# Altium project PCB_Project.PrjPcb
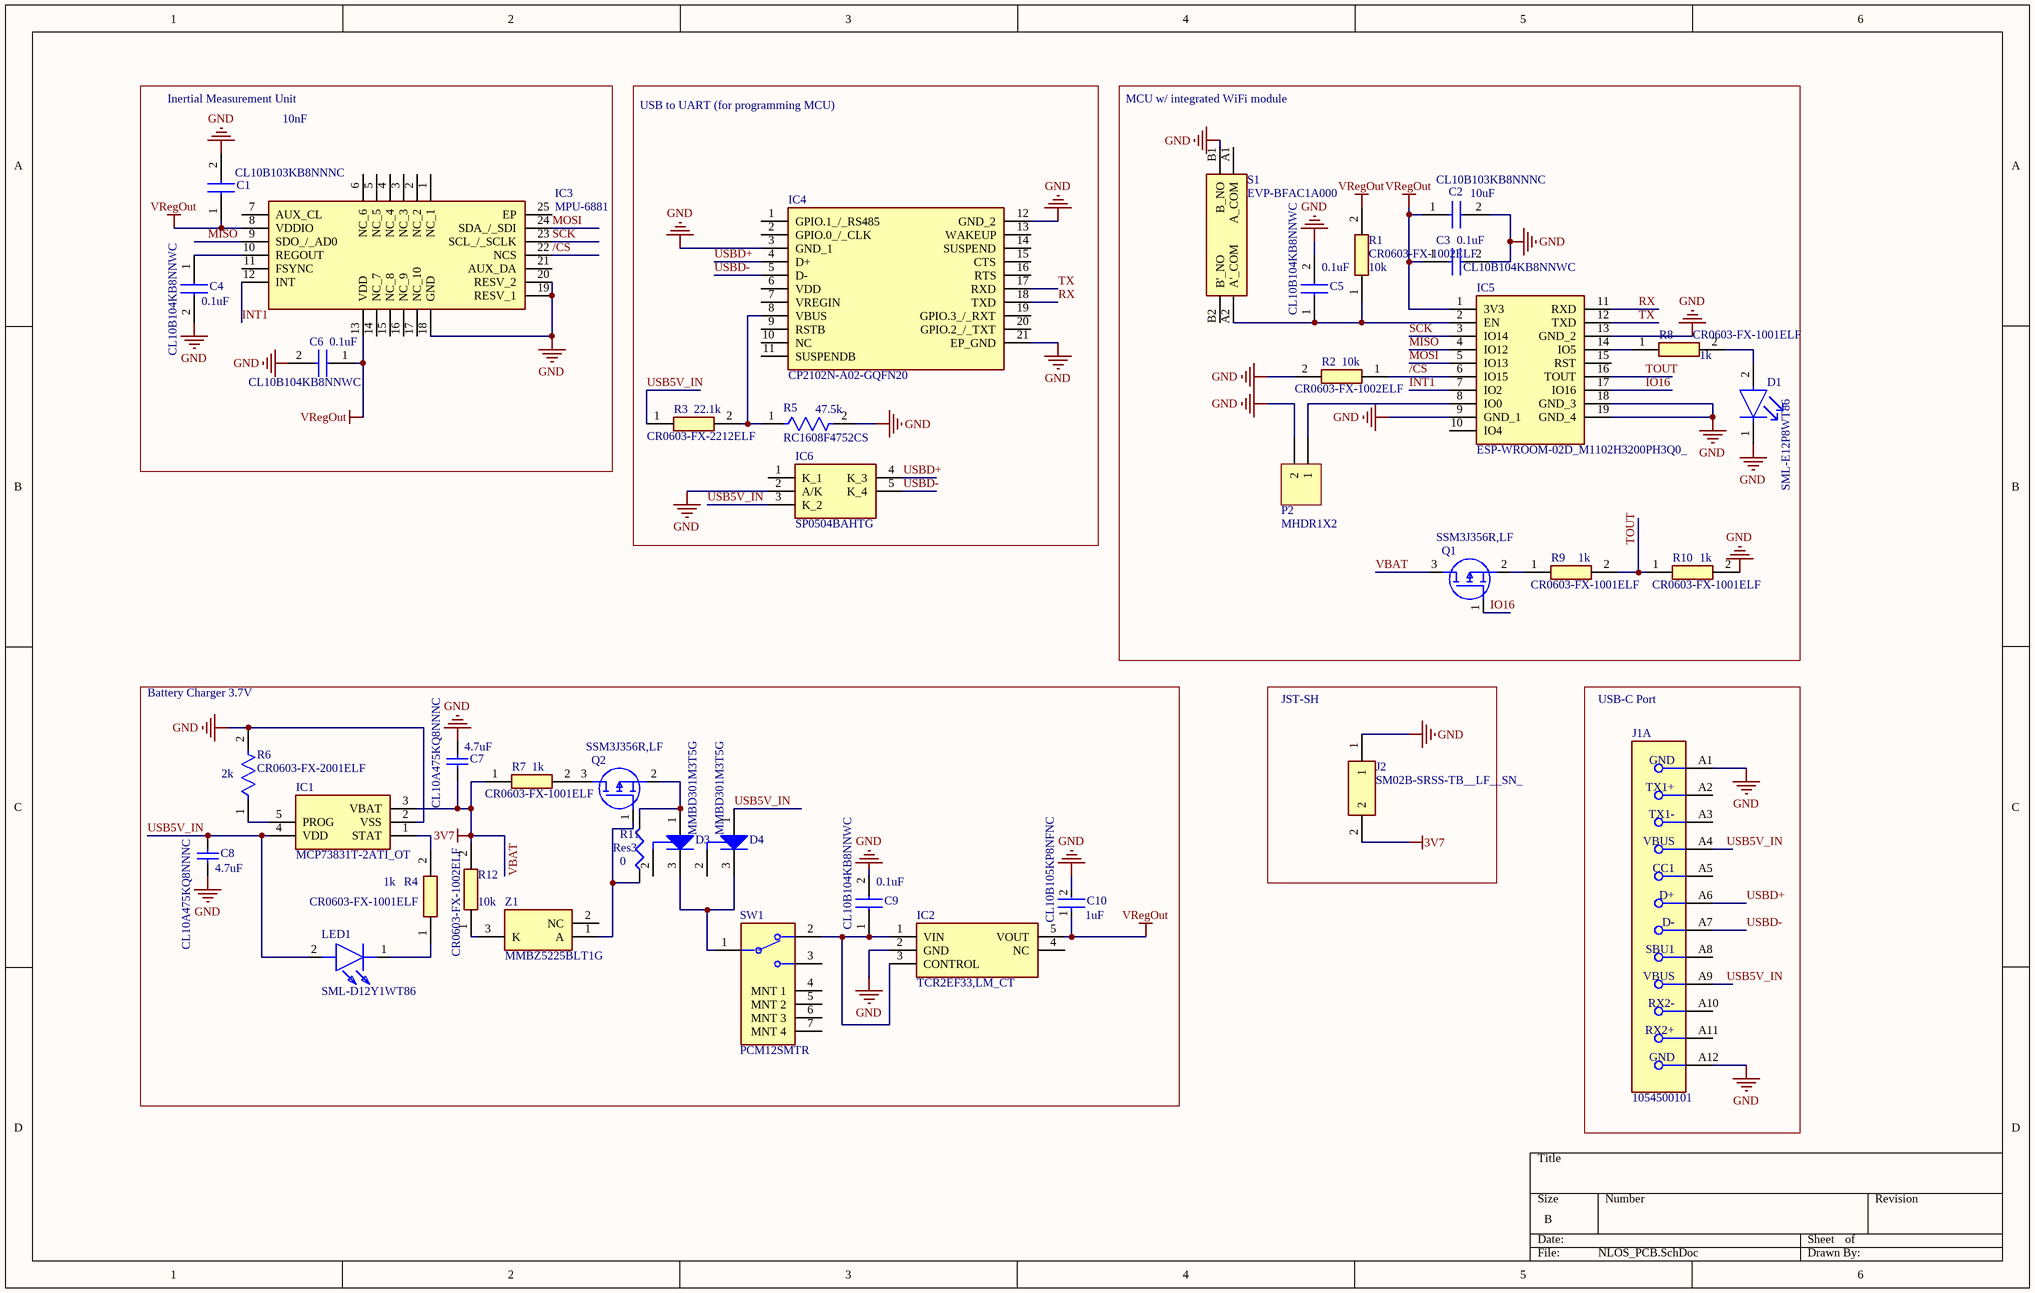
[diagram p0: NLOS_PCB.SchDoc]
1 sheet, 40 parts. Net scope: global (net labels, ports and power ports of the same name join across sheets).
Board file: PCB1.PcbDoc

## Sheet NLOS_PCB.SchDoc
size B; SheetNumber: 1; SheetTotal: 1

### Parts
C1  CL10B103KB8NNNC  [CAPC1608X90N]
C2  CL10B103KB8NNNC  [CAPC1608X90N]
C3  CL10B104KB8NNWC  [CAPC1608X90N]
C4  CL10B104KB8NNWC  [CAPC1608X90N]
C5  CL10B104KB8NNWC  [CAPC1608X90N]
C6  CL10B104KB8NNWC  [CAPC1608X90N]
C7  CL10A475KQ8NNNC  [CAPC1608X90X30LL10T20]
C8  CL10A475KQ8NNNC  [CAPC1608X90X30LL10T20]
C9  CL10B104KB8NNWC  [CAPC1608X90N]
C10  CL10B105KP8NFNC  [FP-CL10-IPC_B]
D1  SML-E12P8WT86  [FP-SML-E12-MFG]
D3  MMBD301M3T5G  [ONSC-SOT-723-3-631AA-01_V]
D4  MMBD301M3T5G  [ONSC-SOT-723-3-631AA-01_V]
IC1  MCP73831T-2ATI_OT  [SOT95P270X145-5N]
IC2  TCR2EF33,LM_CT  [SOT-25]
IC3  MPU-6881  [QFN40P300X300X95-25N-D]
IC4  CP2102N-A02-GQFN20  [CP2102NA02GQFN20]
IC5  ESP-WROOM-02D_M1102H3200PH3Q0_  [ESPWROOM02DM1102H3200PH3Q0]
IC6  SP0504BAHTG  [SOT95P280X145-5N]
J1  1054500101  [FP-1054500101-MFG]  (part A of 3)
J2  SM02B-SRSS-TB__LF__SN_  [SM02B-SRSS-TB]
LED1  SML-D12Y1WT86  [LEDC1608X55N]
P2  MHDR1X2  [MHDR1X2]
Q1  SSM3J356R,LF  [SOT96P240X110-3N]
Q2  SSM3J356R,LF  [SOT96P240X110-3N]
R1  CR0603-FX-1002ELF  [RESC1608X55N]
R2  CR0603-FX-1002ELF  [RESC1608X55N]
R3  CR0603-FX-2212ELF  [RESC1608X55N]
R4  CR0603-FX-1001ELF  [RESC1608X55N]
R5  RC1608F4752CS  [FP-RC1608-MFG]
R6  CR0603-FX-2001ELF  [FP-CR0603-IPC_A]
R7  CR0603-FX-1001ELF  [RESC1608X55N]
R8  CR0603-FX-1001ELF  [RESC1608X55N]
R9  CR0603-FX-1001ELF  [RESC1608X55N]
R10  CR0603-FX-1001ELF  [RESC1608X55N]
R11  Res3  value 0  [J1-0603]
R12  CR0603-FX-1002ELF  [RESC1608X55N]
S1  EVP-BFAC1A000  [EVPBFAC1A000]
SW1  PCM12SMTR  [FP-PCM12SMTR-MFG]
Z1  MMBZ5225BLT1G  [SOT96P237X111-3N]

### Blocks framed on the sheet
JST-SH: J2
USB-C Port: J1

### Nets
GND: C1.2 C2.2 C3.2 C4.2 C5.2 C6.2 C7.2 C8.1 C9.2 C10.2 D1.1(C) IC1.2(VSS) IC2.2(GND) IC3.18(GND) IC3.19(RESV_1) IC3.20(RESV_2) IC4.3(GND_1) IC4.12(GND_2) IC4.21(EP_GND) IC5.9(GND_1) IC5.13(GND_2) IC5.18(GND_3) IC5.19(GND_4) IC6.2(A/K) J1.A1(GND) J1.A12(GND) J2.1 P2.2 R2.2 R5.2 R6.2 R10.2 S1.B1(B_NO)
VBAT: C7.1 IC1.3(VBAT) J2.2 Q1.3(D) R7.1 R12.2  [also labelled 3V7]
VRegOut: C1.1 C2.1 C3.1 C6.1 C10.1 IC2.5(VOUT) IC3.8(VDDIO) IC3.13(VDD) IC5.1(3V3) R1.2
/CS: IC3.22(NCS) IC5.6(IO15) R2.1
INT1: IC3.12(INT) IC5.7(IO2)
IO16: IC5.17(IO16) Q1.1(G)
MISO: IC3.9(SDO_/_AD0) IC5.4(IO12)
MOSI: IC3.24(SDA_/_SDI) IC5.5(IO13)
RX: IC4.18(TXD) IC5.11(RXD)
SCK: IC3.23(SCL_/_SCLK) IC5.3(IO14)
TOUT: IC5.16(TOUT) R9.2 R10.1
TX: IC4.17(RXD) IC5.12(TXD)
USB5V_IN: C8.2 D4.1(A) IC1.4(VDD) IC6.3(K_2) J1.A4(VBUS) J1.A9(VBUS) LED1.2(A) R3.1
USBD+: IC4.4(D+) IC6.4(K_3) J1.A6(D+)
USBD-: IC4.5(D-) IC6.5(K_4) J1.A7(D-)
NetC4_1: C4.1 IC3.10(REGOUT)
NetC5_1: C5.1 IC5.2(EN) R1.1 S1.A2(A'_COM)
NetC9_1: C9.1 IC2.1(VIN) IC2.3(CONTROL) SW1.2
NetD1_2: D1.2(A) R8.2
NetD3_1: D3.1(A) Q2.2(S) R11.2
NetD3_3: D3.3(K) D4.3(K) SW1.1
NetIC1_1: IC1.1(STAT) R4.2
NetIC1_5: IC1.5(PROG) R6.1
NetIC4_8: IC4.8(VBUS) R3.2 R5.1
NetIC5_8: IC5.8(IO0) P2.1
NetIC5_14: IC5.14(IO5) R8.1
NetLED1_1: LED1.1(K) R4.1
NetQ1_2: Q1.2(S) R9.1
NetQ2_1: Q2.1(G) R11.1 Z1.1(A)
NetQ2_3: Q2.3(D) R7.2
NetR12_1: R12.1 Z1.3(K)

Not connected (* = marked no-connect by the designer): D3 2(NC); D4 2(NC); IC2 4(NC); IC3 1(NC_1) 2(NC_2) 3(NC_3) 4(NC_4) 5(NC_5) 6(NC_6) 7(AUX_CL) 11(FSYNC) 14(NC_7) 15(NC_8) 16(NC_9) 17(NC_10) 21(AUX_DA) 25(EP); IC4 1(GPIO.1_/_RS485) 2(GPIO.0_/_CLK) 6(VDD) 7(VREGIN) 9(RSTB) 10(NC) 11(SUSPENDB) 13(WAKEUP) 14(SUSPEND) 15(CTS) 16(RTS) 19(GPIO.3_/_RXT) 20(GPIO.2_/_TXT); IC5 10(IO4) 15(RST); IC6 1(K_1); J1 A2(TX1+) A3(TX1-) A5(CC1) A8(SBU1) A10(RX2-) A11(RX2+); S1 A1(A_COM) B2(B'_NO); SW1 3 4(MNT_1) 5(MNT_2) 6(MNT_3) 7(MNT_4); Z1 2(NC)

### Notes on the sheet
- Inertial Measurement Unit
- MCU w/ integrated WiFi module
- 10nF
- USB to UART (for programming MCU)
- (near C2) 10uF
- 0.1uF
- (near R1) 10k
- (near C4) 0.1uF
- (near C6) 0.1uF
- (near R2) 10k
- (near R8) 1k
- (near R3) 22.1k
- (near R5) 47.5k
- (near R9) 1k
- (near R10) 1k
- Battery Charger 3.7V
- (near R6) 2k
- (near C7) 4.7uF
- (near R7) 1k
- (near C8) 4.7uF
- 1k
- (near R12) 10k
- (near C9) 0.1uF
- (near C10) 1uF

### Library data of the parts
C1 C2 = CL10B103KB8NNNC: Capacitor; Manufacturer_Name: Samsung Electro-Mechanics; Datasheet Link: https://datasheet.datasheetarchive.com/originals/distributors/Datasheets_SAMA/f3f01ceab90a863c6d6e9eba92d45bd3.pdf; Height: 0.9mm; Manufacturer_Part_Number: CL10B103KB8NNNC; Mouser Part Number: 187-CL10B103KB8NNNC; Mouser Price/Stock: https://www.mouser.co.uk/ProductDetail/Samsung-Electro-Mechanics/CL10B103KB8NNNC?qs=349EhDEZ59pAsZxZjVI0UQ%3D%3D; Arrow Part Number: CL10B103KB8NNNC; Arrow Price/Stock: https://www.arrow.com/en/products/cl10b103kb8nnnc/samsung-electro-mechanics?region=nac
C3-C6 C9 = CL10B104KB8NNWC: Capacitor; Manufacturer_Name: Samsung Electro-Mechanics; Datasheet Link: http://www.samsungsem.com/kr/support/product-search/mlcc/CL10B104KB8NNWC.jsp; Height: 0.9mm; Manufacturer_Part_Number: CL10B104KB8NNWC
C7 C8 = CMP-2000-06090-1: Chip Capacitor, 4.7 uF, +/- 10%, 6.3 V, -55 to 85 degC, 0603 (1608 Metric), RoHS, Tape and Reel; Manufacturer: Samsung Electro-Mechanics; Dielectric: X5R; Capacitance: 4700000pF; Rated Voltage: 6.3V; Manufacturer URL: http://www.samsungsem.com/global/index.jsp; Case Size/Dimension: 0603; Package Description: 2-Pin Surface Mount Device, Body 1.60 x 0.80 mm; Datasheet Version: 07/2016; Datasheet URL: http://www.samsungsem.com/kr/support/product-search/mlcc/__icsFiles/afieldfile/2016/08/18/S_CL10A475KQ8NNNC.pdf; Tolerance (%): ±10%; Mounting Technology: SurfaceMount; Package Reference: 0603
C10 = CMP-13271-002470-1: Cap Ceramic 1uF 10V X7R ±10% Pad SMD 0603 +125°C T/R; Dielectric: X7R; Width: 0.031inch; Packaging: Tape and Reel; Voltage Rating: 10V; Length: 0.063inch; Capacitance: 1uF; Radiation Hardening: No; Case Code (Metric): 1608; Mount: Surface Mount; Min Operating Temperature: -55°C; Case/Package: 0603; Thickness: 0.035inch; Package Quantity: 1; Tolerance: 10%; Case Code (Imperial): 0603; Max Operating Temperature: 125°C; Height: 0.8mm; Depth: 0.8mm
D1 = CMP-08952-000024-1: LED GREEN DIFFUSED 0603 SMD; Manufacturer: Rohm; Led Orientation: Top View; Luminous Intensity: 6.3mcd; Reverse Voltage: 5V; Wavelength: 560nm; Forward Current: 20mA; Power Dissipation: 54mW; Forward Voltage: 2.2V; Temperature Range High: +85°C; Manufacturer Part Number: SML-E12P8WT86; Device Class L3: unset; RoHS: TRUE; Automotive: No; Mouser Description: LED Uni-Color Green 2-Pin Chip 0603(1608Metric) T/R; Package: SML-E12; Temperature: -40°C to +85°C; ComponentLink2URL: https://fscdn.rohm.com/en/products/databook/datasheet/opto/led/chip_mono/sml-e1-e.pdf; Colour: Green; Lead Free: Yes; Temperature Range Low: -40°C; Octopart: https://octopart.com/sml-e12p8wt86-rohm-9290854; Category: Diode; Digikey Description: LED GREEN DIFFUSED 0603 SMD; Device Class L1: Optoelectronics; Height: 0.4mm; Device Class L2: LEDs; ComponentLink2Description: Datasheet
D3 D4 = CMP-1055-00589-1: Silicon Hot-Carrier Diode, Schottky Barrier Diode, 3-Pin SOT-723, Pb-Free, Tape and Reel; Manufacturer: On Semiconductor; Configuration: Single; RoHS: TRUE; Mounting Technology: Surface Mount; PartNumber: MMBD301M3T5G; ComponentLink1Description: Manufacturer URL; ComponentLink1URL: http://www.onsemi.com/; PackageDescription: 3-Pin Small Outline Transistor, Body 1.2 x 0.8 mm, Pitch 0.4 mm; PackageVersion: Rev. D, 08/2009; ComponentLink3Description: Package Specification; DatasheetVersion: Rev. 1; ComponentLink2Description: Datasheet; PackageReference: SOT-723-3-631AA-01; ComponentLink2URL: http://www.onsemi.cn/pub_link/Collateral/MMBD301M3-D.PDF; ComponentLink3URL: http://www.onsemi.com/pub_link/Collateral/631AA.PDF; Packing: Tape and Reel
IC1 = MCP73831T-2ATI_OT: Integrated Circuit; Manufacturer_Name: Microchip; Manufacturer_Part_Number: MCP73831T-2ATI/OT; Datasheet Link: https://datasheet.datasheetarchive.com/originals/distributors/Datasheets-DGA15/727147.pdf; Height: 1.45mm; Mouser Part Number: 579-MCP73831T-2ATIOT; Mouser Price/Stock: https://www.mouser.co.uk/ProductDetail/Microchip-Technology/MCP73831T-2ATI-OT?qs=yUQqVecv4qsZbioEUu%252B83g%3D%3D; Arrow Part Number: MCP73831T-2ATI/OT; Arrow Price/Stock: https://www.arrow.com/en/products/mcp73831t-2atiot/microchip-technology?region=nac
IC2 = TCR2EF33,LM_CT: Integrated Circuit; Manufacturer_Name: Toshiba; Manufacturer_Part_Number: TCR2EF33,LM(CT; Datasheet Link: https://toshiba.semicon-storage.com/eu/product/linear/power-supply/detail.TCR2EF33.html; Mouser Part Number: 757-TCR2EF33LMCT; Mouser Price/Stock: https://www.mouser.co.uk/ProductDetail/Toshiba/TCR2EF33LMCT?qs=EPmvyOv1YlPmhsvS3PaWfg%3D%3D; Arrow Part Number: TCR2EF33,LM(CT; Arrow Price/Stock: https://www.arrow.com/en/products/tcr2ef33lm-ct/toshiba
IC3 = MPU-6881: Integrated Circuit; Manufacturer_Name: TDK; Datasheet Link: https://www.semiconductorstore.com/Images/Items/Uploaded/0236/mpu-6881-a7be4.pdf; Height: 0.95mm; Manufacturer_Part_Number: MPU-6881; Mouser Part Number: 410-MPU-6881; Mouser Price/Stock: https://www.mouser.co.uk/ProductDetail/TDK-InvenSense/MPU-6881?qs=u4fy%2FsgLU9MthFpyRcZ0%252Bg%3D%3D; Arrow Part Number: MPU-6881; Arrow Price/Stock: https://www.arrow.com/en/products/mpu-6881/invensense?region=nac
IC4 = CP2102N-A02-GQFN20: Integrated Circuit; Manufacturer_Name: Silicon Labs; Datasheet Link: https://www.silabs.com/documents/public/data-sheets/cp2102n-datasheet.pdf; Height: 0.8mm; Manufacturer_Part_Number: CP2102N-A02-GQFN20; Mouser Part Number: 634-CP2102NA02GQFN20; Mouser Price/Stock: https://www.mouser.co.uk/ProductDetail/Silicon-Labs/CP2102N-A02-GQFN20?qs=u16ybLDytRaG8WdlP0fT2g%3D%3D; Arrow Part Number: CP2102N-A02-GQFN20; Arrow Price/Stock: https://www.arrow.com/en/products/cp2102n-a02-gqfn20/silicon-labs?region=nac
IC5 = ESP-WROOM-02D_M1102H3200PH3Q0_: Integrated Circuit; Manufacturer_Name: Espressif Systems; Manufacturer_Part_Number: ESP-WROOM-02D(M1102H3200PH3Q0); Datasheet Link: https://www.mouser.com.tr/datasheet/2/891/esp-wroom-02d_esp-wroom-02u_datasheet_en-1365835.pdf; Height: 3.3mm; Mouser Part Number: 356-ESPWROOM02D(4MB); Mouser Price/Stock: https://www.mouser.co.uk/ProductDetail/Espressif-Systems/ESP-WROOM-02DM1102H3200PH3Q0?qs=W%2FMpXkg%252BdQ6VfEEQ948I3Q%3D%3D
IC6 = SP0504BAHTG: Integrated Circuit; Manufacturer_Name: LITTELFUSE; Datasheet Link: http://componentsearchengine.com/Datasheets/1/SP0504BAHTG.pdf; Height: 1.45mm; Manufacturer_Part_Number: SP0504BAHTG; Mouser Part Number: 576-SP0504BAHTG; Mouser Price/Stock: https://www.mouser.co.uk/ProductDetail/Littelfuse/SP0504BAHTG?qs=zR8PVLWe1trv9sWzoBaD%252Bg%3D%3D; Arrow Part Number: SP0504BAHTG; Arrow Price/Stock: https://www.arrow.com/en/products/sp0504bahtg/littelfuse
J1 = CMP-04767-000004-1: CONN RCP USB3.1 TYPEC 24P SMD RA; Manufacturer: Molex; Number Of Contacts: 24; Voltage Rating: 30V; Shielding: true; Is Female: yes; Current Rating: 0.25/1.25/5A; Pitch: 0.5mm; Conn Orientation: Right Angle; Package: 0; Height: 3.44mm; Footprint Url: https://www.molex.com/pdm_docs/sd/1054500101_sd.pdf; Device Class L1: Connectors; Category: Conn; Device Class L2: USB Connectors; Digikey Description: CONN RCP USB3.1 TYPEC 24P SMD RA; Contact Material: Gold,Nickel; Mouser Description: USB Shielded I/O Receptacle; Type C; Right Angle; Surface Mount; Gold over Nickel; ComponentLink2Description: Datasheet; Lead Free: Yes; Automotive: No; Temperature Range High: +85°C; RoHS: TRUE; Octopart: https://octopart.com/105450-0101-molex-68082325; ComponentLink2URL: https://www.molex.com/webdocs/datasheets/pdf/en-us/1054500101_IO_CONNECTORS.pdf; Temperature: -30°C to +85°C; Usb Standard: USB 3.1; Temperature Range Low: -30°C; Device Class L3: unset; Manufacturer Part Number: 1054500101
J2 = SM02B-SRSS-TB__LF__SN_: Connector; Manufacturer_Name: JST (JAPAN SOLDERLESS TERMINALS); Manufacturer_Part_Number: SM02B-SRSS-TB (LF)(SN); Datasheet Link: http://www.jst-mfg.com/product/pdf/eng/eSH.pdf
LED1 = SML-D12Y1WT86: LED; Manufacturer_Name: ROHM Semiconductor; Datasheet Link: https://componentsearchengine.com/Datasheets/1/SML-D12Y1WT86.pdf; Height: 0.55mm; Manufacturer_Part_Number: SML-D12Y1WT86; Mouser Part Number: 755-SML-D12Y1WT86; Mouser Price/Stock: https://www.mouser.co.uk/ProductDetail/ROHM-Semiconductor/SML-D12Y1WT86?qs=M3jcYzEJUdG%2FAKvzZK%252Bz7w%3D%3D
P2 = MHDR1X2: Header, 2-Pin; LatestRevisionDate: 17-Jul-2002; LatestRevisionNote: Re-released for DXP Platform.; Publisher: Altium Limited
Q1 Q2 = SSM3J356R,LF: MOSFET (P-Channel); Manufacturer_Name: Toshiba; Datasheet Link: http://toshiba.semicon-storage.com/info/docget.jsp?did=30685&prodName=SSM3J356R; Height: 0.88mm; Manufacturer_Part_Number: SSM3J356R,LF; Mouser Part Number: 757-SSM3J356RLF; Mouser Price/Stock: https://www.mouser.co.uk/ProductDetail/Toshiba/SSM3J356RLF?qs=lhkzy8lC%252BSsL%2F1yLGjMnQA%3D%3D; Arrow Part Number: SSM3J356R,LF; Arrow Price/Stock: https://www.arrow.com/en/products/ssm3j356rlf/toshiba?region=nac
R1 R2 R12 = CR0603-FX-1002ELF: Resistor; Manufacturer_Name: Bourns; Datasheet Link: https://www.bourns.com/pdfs/chpreztr.pdf; Height: 0.55mm; Manufacturer_Part_Number: CR0603-FX-1002ELF; Mouser Part Number: 652-CR0603FX-1002ELF; Mouser Price/Stock: https://www.mouser.co.uk/ProductDetail/Bourns/CR0603-FX-1002ELF?qs=K5ddiUFZPT6XHG0dQH96QA%3D%3D; Arrow Part Number: CR0603-FX-1002ELF; Arrow Price/Stock: https://www.arrow.com/en/products/cr0603-fx-1002elf/bourns?region=nac
R3 = CR0603-FX-2212ELF: Resistor; Manufacturer_Name: Bourns; Datasheet Link: https://www.bourns.com/pdfs/chpreztr.pdf; Height: 0.55mm; Manufacturer_Part_Number: CR0603-FX-2212ELF; Mouser Part Number: 652-CR0603FX-2212ELF; Mouser Price/Stock: https://www.mouser.co.uk/ProductDetail/Bourns/CR0603-FX-2212ELF?qs=zx2075yZkZJFzojWSdyX6Q%3D%3D; Arrow Part Number: CR0603-FX-2212ELF; Arrow Price/Stock: https://www.arrow.com/en/products/cr0603-fx-2212elf/bourns
R4 R7-R10 = CR0603-FX-1001ELF: Resistor; Manufacturer_Name: Bourns; Datasheet Link: https://www.bourns.com/pdfs/chpreztr.pdf; Height: 0.55mm; Manufacturer_Part_Number: CR0603-FX-1001ELF; Mouser Part Number: 652-CR0603FX-1001ELF; Mouser Price/Stock: https://www.mouser.co.uk/ProductDetail/Bourns/CR0603-FX-1001ELF?qs=K5ddiUFZPT4YQXF75Ui8dQ%3D%3D; Arrow Part Number: CR0603-FX-1001ELF; Arrow Price/Stock: https://www.arrow.com/en/products/cr0603-fx-1001elf/bourns?region=nac
R5 = CMP-13261-003173-1: Res Thick Film 0603 47.5kΩ 1% 0.1W ±100ppm/°C Molded SMD T/R; Voltage Rating (DC): 50V; Max Power Dissipation: 100mW; Resistance: 47.5kR; Features: Moisture Resistant; Depth: 0.8mm; Case/Package: 0603; Height: 0.022inch; Case Code (Metric): 1608; Radiation Hardening: No; Max Operating Temperature: 155°C; Length: 0.063inch; Lead Free: Lead Free; Power Rating: 100mW; Temperature Coefficient: 100ppm/°C; Number of Terminations: 2; Min Operating Temperature: -55°C; Packaging: Tape and Reel; Width: 0.031inch; Case Code (Imperial): 0603; Contact Plating: Tin; Tolerance: 1%; Composition: Thick Film; Military Standard: Not
R6 = CMP-07231-005707-1: Thick Film Chip Resistors 0603 2kΩ 0.1W 1% 100ppm/°C; Voltage Rating: 50V; Resistance: 2kR; Power Rating: 100mW; Case Code (Imperial): 0603; Number of Pins: 2; Termination: SMD/SMT; Package Quantity: 1; Min Operating Temperature: -55°C; Features: Moisture Resistant; Voltage Rating (DC): 50V; Depth: 0.8mm; Temperature Coefficient: 100ppm/°C; Height: 0.45mm; Case/Package: 0603; Thickness: 457um; Tolerance: 1%; Packaging: Tape and Reel; Contact Plating: Tin; Number of Terminations: 2; Composition: Thick Film; Case Code (Metric): 1608; Max Power Dissipation: 100mW; Length: 1.6mm; Width: 0.8mm; Mount: Surface Mount; Radiation Hardening: No; Military Standard: Not; REACH SVHC: No SVHC; Max Operating Temperature: 155°C
R11 = Res3: Resistor; Published: 8-Jun-2000; LatestRevisionDate: 29-May-2009; LatestRevisionNote: IPC-7351 Footprint Added.; PackageReference: J1-0603; Publisher: Altium Limited; PackageDescription: Chip Resistor
S1 = EVP-BFAC1A000: Switch; Manufacturer_Name: Panasonic; Datasheet Link: https://industrial.panasonic.com/cdbs/www-data/pdf/ATK0000/ATK0000C432.pdf; Height: 3.7mm; Manufacturer_Part_Number: EVP-BFAC1A000; Mouser Part Number: 667-EVP-BFAC1A000; Mouser Price/Stock: https://www.mouser.co.uk/ProductDetail/Panasonic/EVP-BFAC1A000?qs=OiaALIbqWFSeImjptaxnOQ%3D%3D; Arrow Part Number: EVP-BFAC1A000; Arrow Price/Stock: https://www.arrow.com/en/products/evp-bfac1a000/panasonic
SW1 = CMP-2000-06884-2: SWITCH SLIDE SPDT 300MA 6V; Actuator Material: Nylon; Switch Function: On-On; Insulation Resistance: 100mR; Actuator Type: Standard; Mechanical Life: 10000Cycles; Actuator Length: 1.5mm; Contact Resistance: 70mR; Min Operating Temperature: -20°C; Max Current Rating: 300mA; Max Voltage Rating (DC): 6V; Package Quantity: 1; Mount: Surface Mount; Packaging: Tape and Reel; Contact Plating: Silver; Depth: 5mm; REACH SVHC: No SVHC; Voltage Rating (DC): 6V; Voltage Rating (AC): 6V; Max Operating Temperature: 85°C; Length: 7.7mm; Termination: Gull Wing; Current Rating: 300mA; Contact Current Rating: 300mA; Orientation: Right Angle; Width: 6.7mm; Switch Travel: 1.5mm; Lead Free: Lead Free; Contact Material: Copper Alloy; Throw Configuration: SPDT
Z1 = MMBZ5225BLT1G: Zener Diode; Manufacturer_Name: ON Semiconductor; Datasheet Link: https://www.onsemi.com/pdf/datasheet/mmbz5221blt1-d.pdf; Height: 1.11mm; Manufacturer_Part_Number: MMBZ5225BLT1G; Mouser Part Number: 863-MMBZ5225BLT1G; Mouser Price/Stock: https://www.mouser.co.uk/ProductDetail/onsemi/MMBZ5225BLT1G?qs=P4IOph%252Bbot8UVWwuT5140A%3D%3D